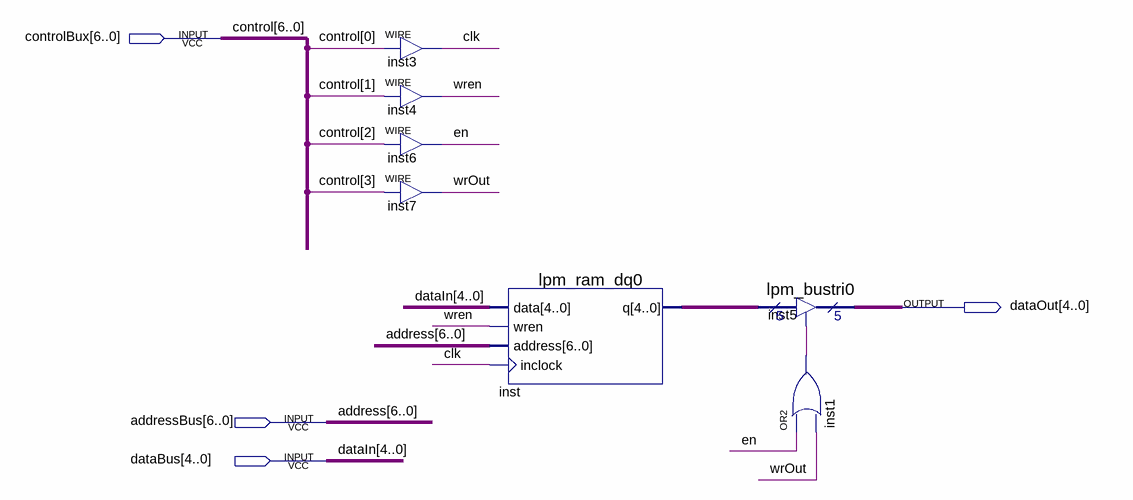
[diagram p0: schematic sheet]
// Quartus schematic RAM.bdf as structural Verilog: 7 symbols, 4 pins
module RAM (
  input  [6:0] controlBux,
  input  [6:0] addressBus,
  input  [4:0] dataBus,
  output [4:0] dataOut
);

  wire clk, en, inst1_out, wren, wrOut;
  wire [4:0] inst_q;

  assign clk = controlBux[0];  // WIRE inst3
  assign wren = controlBux[1];  // WIRE inst4
  assign en = controlBux[2];  // WIRE inst6
  assign wrOut = controlBux[3];  // WIRE inst7
  lpm_ram_dq0 inst (.data(dataBus), .wren(wren), .address(addressBus), .inclock(clk), .q(inst_q));
  lpm_bustri0 inst5 (.enabledt(inst1_out), .data(inst_q), .tridata(dataOut));
  or inst1 (inst1_out, en, wrOut);

  // Other names for the same wires on the sheet: address[6:0] = addressBus; control[6:0] = controlBux;
  //   dataIn[4:0] = dataBus
endmodule
